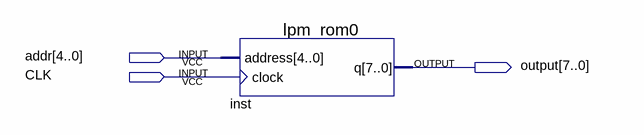
[diagram p0: schematic sheet]
// Quartus schematic rom.bdf as structural Verilog: 1 symbols, 3 pins
module rom (
  input  [4:0] addr,
  input  CLK,
  output [7:0] \output 
);

  lpm_rom0 inst (.address(addr), .clock(CLK), .q(\output ));
endmodule
